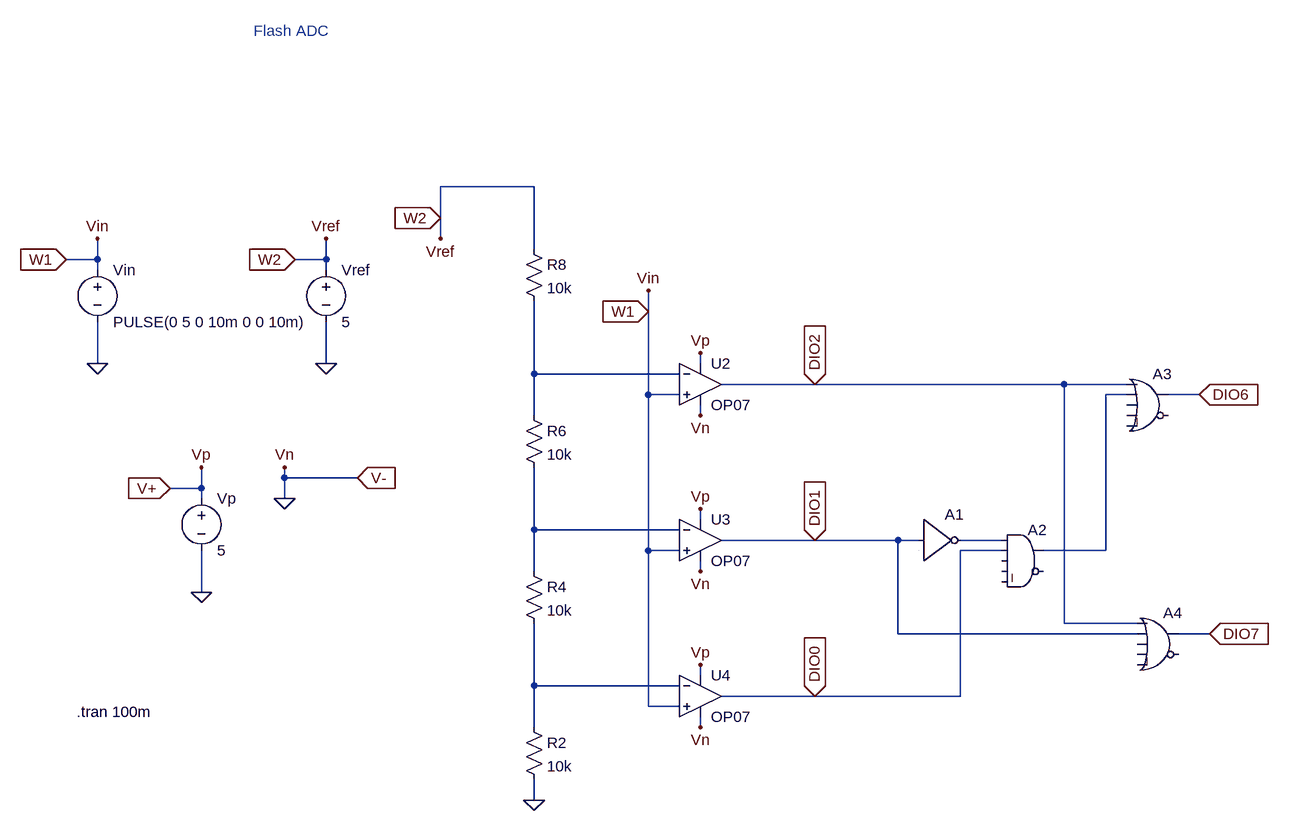
[diagram p0: schematic flash_adc.asc]
flash_adc.asc, the LTspice schematic file:
Version 4
SHEET 1 1188 680
WIRE -480 -944 -624 -944
WIRE -624 -896 -624 -944
WIRE -624 -864 -624 -896
WIRE -480 -848 -480 -944
WIRE -1152 -832 -1152 -864
WIRE -1152 -832 -1200 -832
WIRE -800 -832 -800 -864
WIRE -800 -832 -848 -832
WIRE -1152 -816 -1152 -832
WIRE -800 -816 -800 -832
WIRE -304 -752 -304 -784
WIRE -1152 -672 -1152 -736
WIRE -800 -672 -800 -736
WIRE -224 -672 -224 -688
WIRE -480 -656 -480 -768
WIRE -256 -656 -480 -656
WIRE -48 -640 -192 -640
WIRE 336 -640 -48 -640
WIRE 432 -640 336 -640
WIRE -304 -624 -304 -752
WIRE -256 -624 -304 -624
WIRE 432 -624 400 -624
WIRE 544 -624 496 -624
WIRE -480 -592 -480 -656
WIRE -224 -592 -224 -608
WIRE -864 -496 -864 -512
WIRE -752 -496 -864 -496
WIRE -992 -480 -992 -512
WIRE -992 -480 -1040 -480
WIRE -992 -464 -992 -480
WIRE -864 -464 -864 -496
WIRE -224 -432 -224 -448
WIRE -480 -416 -480 -512
WIRE -256 -416 -480 -416
WIRE -48 -400 -192 -400
WIRE 80 -400 -48 -400
WIRE 112 -400 80 -400
WIRE 240 -400 176 -400
WIRE -304 -384 -304 -624
WIRE -256 -384 -304 -384
WIRE 240 -384 176 -384
WIRE 400 -384 400 -624
WIRE 400 -384 304 -384
WIRE -480 -352 -480 -416
WIRE -224 -352 -224 -368
WIRE -992 -320 -992 -384
WIRE 336 -272 336 -640
WIRE 448 -272 336 -272
WIRE 80 -256 80 -400
WIRE 448 -256 80 -256
WIRE 560 -256 512 -256
WIRE -224 -192 -224 -208
WIRE -480 -176 -480 -272
WIRE -256 -176 -480 -176
WIRE -48 -160 -192 -160
WIRE 176 -160 176 -384
WIRE 176 -160 -48 -160
WIRE -304 -144 -304 -384
WIRE -256 -144 -304 -144
WIRE -480 -112 -480 -176
WIRE -224 -112 -224 -128
WIRE -480 0 -480 -32
FLAG -992 -320 0
FLAG -992 -512 Vp
FLAG -864 -512 Vn
FLAG -224 -208 Vp
FLAG -224 -112 Vn
FLAG -480 0 0
FLAG -224 -448 Vp
FLAG -224 -352 Vn
FLAG -224 -688 Vp
FLAG -224 -592 Vn
FLAG -800 -672 0
FLAG -800 -864 Vref
FLAG -624 -864 Vref
FLAG -1152 -672 0
FLAG -1152 -864 Vin
FLAG -304 -784 Vin
FLAG -864 -464 0
FLAG -1200 -832 W1
IOPIN -1200 -832 In
FLAG -1040 -480 V+
IOPIN -1040 -480 In
FLAG -848 -832 W2
IOPIN -848 -832 In
FLAG -48 -160 DIO0
IOPIN -48 -160 In
FLAG -48 -400 DIO1
IOPIN -48 -400 In
FLAG -48 -640 DIO2
IOPIN -48 -640 In
FLAG -752 -496 V-
IOPIN -752 -496 In
FLAG -624 -896 W2
IOPIN -624 -896 In
FLAG -304 -752 W1
IOPIN -304 -752 In
FLAG 544 -624 DIO6
IOPIN 544 -624 In
FLAG 560 -256 DIO7
IOPIN 560 -256 In
SYMBOL voltage -992 -480 R0
WINDOW 123 0 0 Left 0
WINDOW 39 0 0 Left 0
SYMATTR InstName Vp
SYMATTR Value 5
SYMBOL res -496 -128 R0
SYMATTR InstName R2
SYMATTR Value 10k
SYMBOL res -496 -368 R0
SYMATTR InstName R4
SYMATTR Value 10k
SYMBOL res -496 -608 R0
SYMATTR InstName R6
SYMATTR Value 10k
SYMBOL res -496 -864 R0
SYMATTR InstName R8
SYMATTR Value 10k
SYMBOL voltage -800 -832 R0
WINDOW 123 0 0 Left 0
WINDOW 39 0 0 Left 0
SYMATTR InstName Vref
SYMATTR Value 5
SYMBOL voltage -1152 -832 R0
WINDOW 123 0 0 Left 0
WINDOW 39 0 0 Left 0
SYMATTR InstName Vin
SYMATTR Value PULSE(0 5 0 10m 0 0 10m)
SYMBOL Opamps\\OP07 -224 -704 R0
SYMATTR InstName U2
SYMBOL Opamps\\OP07 -224 -464 R0
SYMATTR InstName U3
SYMBOL Opamps\\OP07 -224 -224 R0
SYMATTR InstName U4
SYMBOL Digital\\inv 112 -464 R0
SYMATTR InstName A1
SYMATTR Value2 Vhigh=5 Ref=2.5 td=5ns
SYMBOL Digital\\and 272 -432 R0
SYMATTR InstName A2
SYMATTR Value2 Vhigh=5 Ref=2.5 td=5ns
SYMBOL Digital\\or 464 -672 R0
SYMATTR InstName A3
SYMATTR Value2 Vhigh=5 Ref=2.5 td=5ns
SYMBOL Digital\\or 480 -304 R0
SYMATTR InstName A4
SYMATTR Value2 Vhigh=5 Ref=2.5 td=5ns
TEXT -1184 -136 Left 2 !.tran 100m
TEXT -912 -1184 Left 2 ;Flash ADC

The netlist it stands for:
* flash_adc.asc
Vp V+ 0 5
R2 N005 0 10k
R4 N003 N005 10k
R6 N001 N003 10k
R8 W2 N001 10k
Vref W2 0 5
Vin W1 0 PULSE(0 5 0 10m 0 0 10m)
XU2 W1 N001 V+ 0 DIO2 LT1001  ; OP07, pins In+ In- V+ V- OUT
XU3 W1 N003 V+ 0 DIO1 LT1001  ; OP07, pins In+ In- V+ V- OUT
XU4 W1 N005 V+ 0 DIO0 LT1001  ; OP07, pins In+ In- V+ V- OUT
A1 DIO1 0 0 0 0 N004 0 0 BUF Vhigh=5 Ref=2.5 td=5ns
A2 N004 DIO0 0 0 0 0 N002 0 AND Vhigh=5 Ref=2.5 td=5ns
A3 DIO2 N002 0 0 0 0 DIO6 0 OR Vhigh=5 Ref=2.5 td=5ns
A4 DIO2 DIO1 0 0 0 0 DIO7 0 OR Vhigh=5 Ref=2.5 td=5ns
.tran 100m
* Flash ADC
.lib LTC.lib
.backanno
.end